# Altium schematic sheet MB_rpi_sys.SchDoc
size 840 x 594 mm; SheetNumber: 3; SheetTotal: 8
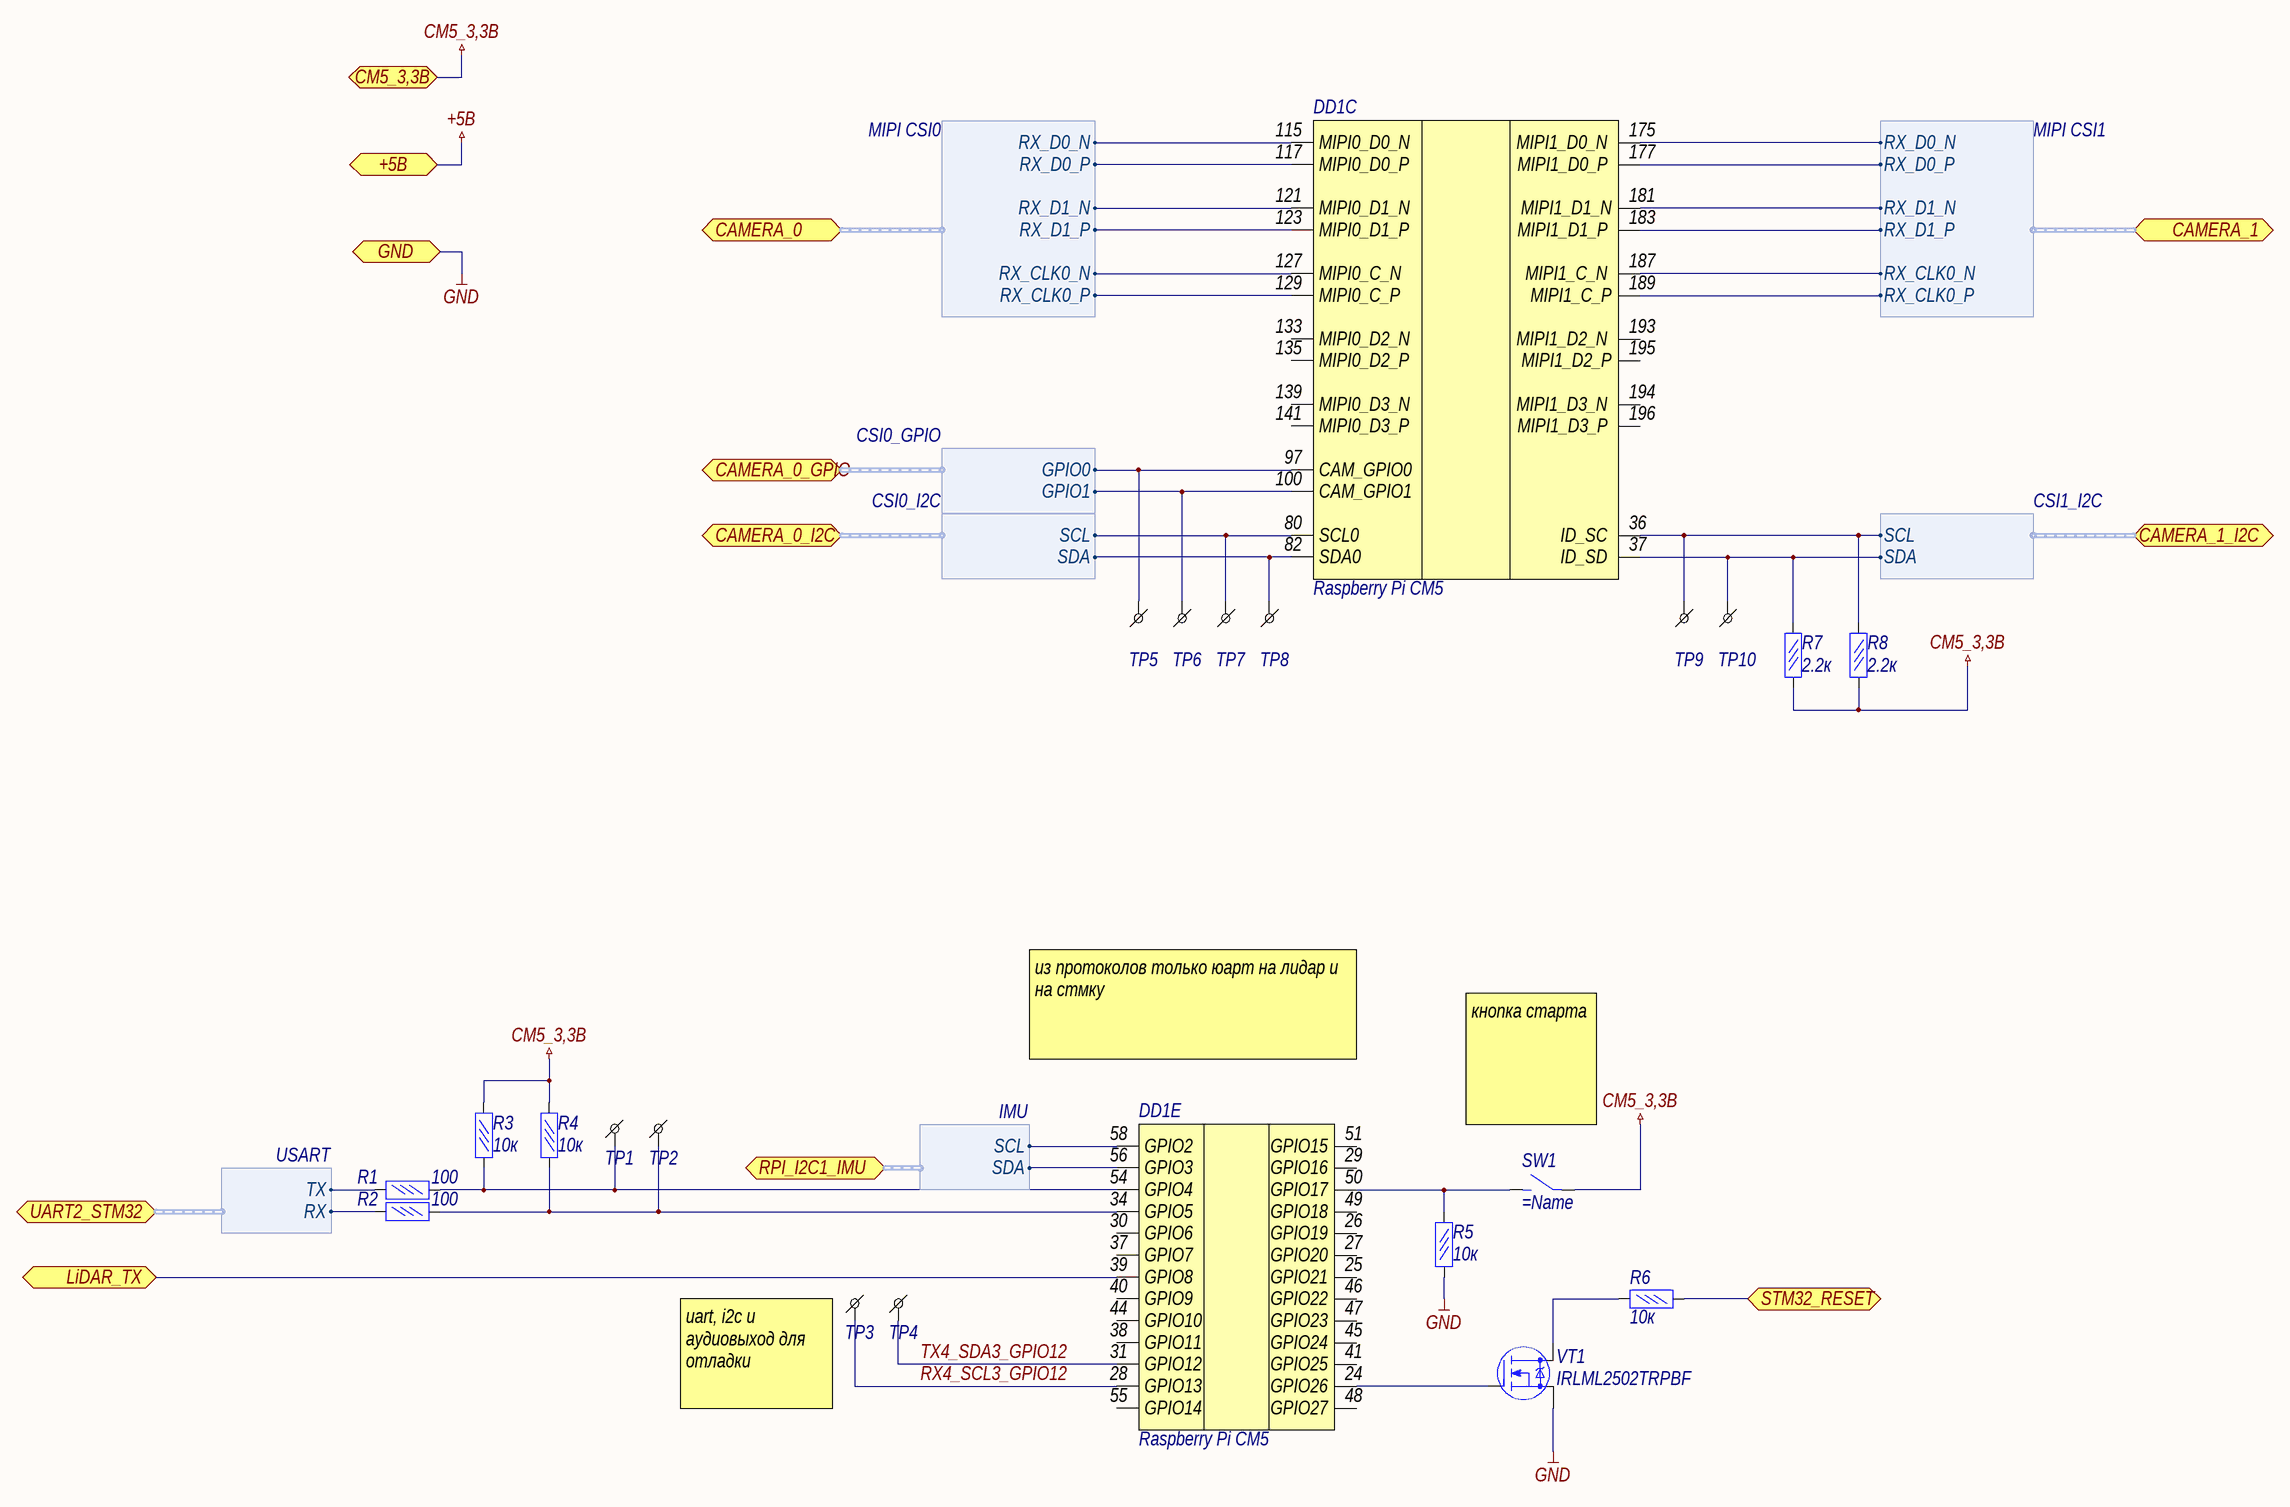
[diagram p0: MB_rpi_sys.SchDoc]

## Parts
DD1  Raspberry Pi CM5  [raspberry_pi_compute_module_4_header]  (parts C,E of 6)
R1  100  [R0402]
R2  100  [R0402]
R3  10к  [R0402]
R4  10к  [R0402]
R5  10к  [R0402]
R6  10к  [R0402]
R7  2.2к  [R0402]
R8  2.2к  [R0402]
SW1  (no value)  [KTD0621]
TP1  TestPoint  [0.5 x 0,9_round]  (value not drawn)
TP2  TestPoint  [0.5 x 0,9_round]  (value not drawn)
TP3  TestPoint  [0.5 x 0,9_round]  (value not drawn)
TP4  TestPoint  [0.5 x 0,9_round]  (value not drawn)
TP5  TestPoint  [0.5 x 0,9_round]  (value not drawn)
TP6  TestPoint  [0.5 x 0,9_round]  (value not drawn)
TP7  TestPoint  [0.5 x 0,9_round]  (value not drawn)
TP8  TestPoint  [0.5 x 0,9_round]  (value not drawn)
TP9  TestPoint  [0.5 x 0,9_round]  (value not drawn)
TP10  TestPoint  [0.5 x 0,9_round]  (value not drawn)
VT1  IRLML2502TRPBF  [SOT23]

## Ports
+5В (bidir), CAMERA_0 (bidir, harness MIPI CSI0), CAMERA_0_GPIO (bidir, harness CSI0_GPIO), CAMERA_0_I2C (bidir, harness CSI0_I2C), CAMERA_1 (bidir, harness MIPI CSI1), CAMERA_1_I2C (bidir, harness CSI1_I2C), CM5_3,3В (bidir), GND (bidir), LiDAR_TX (bidir), RPI_I2C1_IMU (bidir, harness IMU), STM32_RESET (bidir), UART2_STM32 (bidir, harness USART)

## Harnesses
MIPI CSI1: RX_D0_N, RX_D0_P, RX_D1_N, RX_D1_P, RX_CLK0_N, RX_CLK0_P
MIPI CSI0: RX_D0_N, RX_D0_P, RX_D1_N, RX_D1_P, RX_CLK0_N, RX_CLK0_P
CSI0_GPIO: GPIO0, GPIO1
CSI0_I2C: SCL, SDA
CSI1_I2C: SCL, SDA
USART: RX, TX
IMU: SDA, SCL

## Nets
+5В: port +5В
CM5_3,3В: R3.2 R4.2 R7.1 R8.1 SW1.1 ; port CM5_3,3В
GND: R5.1 VT1.2(S) ; port GND
LiDAR_TX: DD1.39(GPIO8) ; port LiDAR_TX
RX4_SCL3_GPIO12: DD1.28(GPIO13) TP3.1
STM32_RESET: R6.1 ; port STM32_RESET
TX4_SDA3_GPIO12: DD1.31(GPIO12) TP4.1
NetDD1_24: DD1.24(GPIO26) VT1.1(G)
NetDD1_34: DD1.34(GPIO5) R2.2 R4.1 TP2.1
NetDD1_36: DD1.36(ID_SC) R8.2 TP9.1 ; port CAMERA_1_I2C.SCL
NetDD1_37: DD1.37(ID_SD) R7.2 TP10.1 ; port CAMERA_1_I2C.SDA
NetDD1_50: DD1.50(GPIO17) R5.2 SW1.2
NetDD1_54: DD1.54(GPIO4) R1.2 R3.1 TP1.1
NetDD1_56: DD1.56(GPIO3) ; port RPI_I2C1_IMU.SDA
NetDD1_58: DD1.58(GPIO2) ; port RPI_I2C1_IMU.SCL
NetDD1_80: DD1.80(SCL0) TP7.1 ; port CAMERA_0_I2C.SCL
NetDD1_82: DD1.82(SDA0) TP8.1 ; port CAMERA_0_I2C.SDA
NetDD1_97: DD1.97(CAM_GPIO0) TP5.1 ; port CAMERA_0_GPIO.GPIO0
NetDD1_100: DD1.100(CAM_GPIO1) TP6.1 ; port CAMERA_0_GPIO.GPIO1
NetDD1_115: DD1.115(MIPI0_D0_N) ; port CAMERA_0.RX_D0_N
NetDD1_117: DD1.117(MIPI0_D0_P) ; port CAMERA_0.RX_D0_P
NetDD1_121: DD1.121(MIPI0_D1_N) ; port CAMERA_0.RX_D1_N
NetDD1_123: DD1.123(MIPI0_D1_P) ; port CAMERA_0.RX_D1_P
NetDD1_127: DD1.127(MIPI0_C_N) ; port CAMERA_0.RX_CLK0_N
NetDD1_129: DD1.129(MIPI0_C_P) ; port CAMERA_0.RX_CLK0_P
NetDD1_175: DD1.175(MIPI1_D0_N) ; port CAMERA_1.RX_D0_N
NetDD1_177: DD1.177(MIPI1_D0_P) ; port CAMERA_1.RX_D0_P
NetDD1_181: DD1.181(MIPI1_D1_N) ; port CAMERA_1.RX_D1_N
NetDD1_183: DD1.183(MIPI1_D1_P) ; port CAMERA_1.RX_D1_P
NetDD1_187: DD1.187(MIPI1_C_N) ; port CAMERA_1.RX_CLK0_N
NetDD1_189: DD1.189(MIPI1_C_P) ; port CAMERA_1.RX_CLK0_P
NetR1_1: R1.1 ; port UART2_STM32.TX
NetR2_1: R2.1 ; port UART2_STM32.RX
NetR6_2: R6.2 VT1.3(D)

Not connected (* = marked no-connect by the designer): DD1 25(GPIO21) 26(GPIO19) 27(GPIO20) 29(GPIO16) 30(GPIO6) 38(GPIO11) 40(GPIO9) 41(GPIO25) 44(GPIO10_) 45(GPIO24) 46(GPIO22) 47(GPIO23) 48(GPIO27) 49(GPIO18) 51(GPIO15) 55(GPIO14) 133(MIPI0_D2_N_) 135(MIPI0_D2_P_) 139(MIPI0_D3_N_) 141(MIPI0_D3_P_) 193(MIPI1_D2_N_) 194(MIPI1_D3_N_) 195(MIPI1_D2_P) 196(MIPI1_D3_P_)

## Notes on the sheet
- из протоколов только юарт на лидар и на стмку
- кнопка старта
- (near TP3) uart, i2c и аудиовыход для отладки
- Подп. и дата
- Инв. № дубл.
- Взам. инв. №
- Инв. № подл.
- Лист
- Изм.
- № докум.
- Подп.
- Дата
- Копировал
- Формат
- А1

## Library data of the parts
DD1 = Raspberry Pi CM5: Raspberry Pi Compute Module 5; Name: Raspberry Pi CM5
R1-R8 = Резистор 0.05Вт: Резистор 0,05Вт
  R1 R2: Value: 100
  R3-R6: Value: 10к
  R7 R8: Value: 2.2к
SW1 = button
VT1 = IRLML2502TRPBF: мосфет n-канал IRLML2502TRPBF; Name: IRLML2502TRPBF